# Altium schematic sheet FIT_HDMI_X25-29.SchDoc: FIT_PM12 board
size 420 x 297 mm; CheckedBy: G.Kasprowicz; Author: INR Moscow; CompanyName: WUT ISE; DrawnBy: M.Podgórski; Organization: WUT ISE; Address1: PW ISE; Address2: Nowowiejska 15/19 00-665 Warsaw; Address3: gkasprow@gmail.com; Revision: 2; SheetNumber: -; SheetTotal: -; ModifiedBy: -; CheckedDate: -; Title2: Title 2; DivGrp: WUT ISE; Designer: INR RAS; ModifiedDate: -; ProjectName: Sensor Box
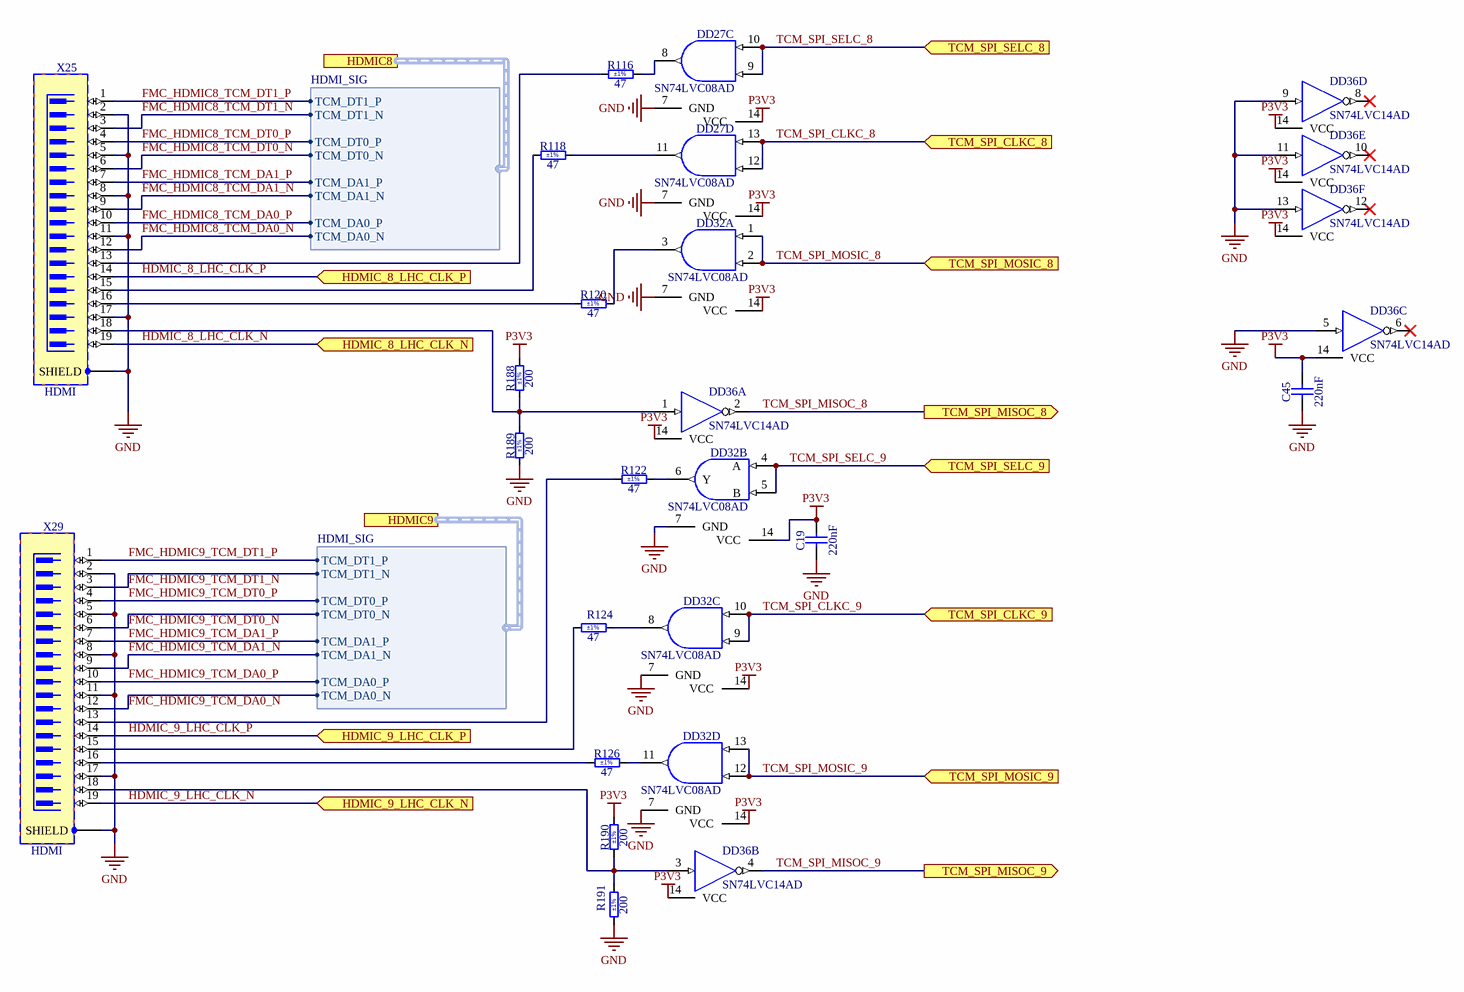
[diagram p0: FIT_HDMI_X25-29.SchDoc]

## Parts
C19  220nF  [CAPC2012X135N]
C45  220nF  [CAPC2012X135N]
DD27  SN74LVC08AD  [SOIC127P600X175-14N]  (parts C,D of 4)
DD32  SN74LVC08AD  [SOIC127P600X175-14N]  (parts A,B,C,D of 4)
DD36  SN74LVC14AD  [SOIC127P600X175-14N]  (parts A,B,C,D,E,F of 6)
R116  47  Tolerance: ±1%  [RESC2012X60N]
R118  47  Tolerance: ±1%  [RESC2012X60N]
R120  47  Tolerance: ±1%  [RESC2012X60N]
R122  47  Tolerance: ±1%  [RESC2012X60N]
R124  47  Tolerance: ±1%  [RESC2012X60N]
R126  47  Tolerance: ±1%  [RESC2012X60N]
R188  200  Tolerance: ±1%  [RESC2012X60N]
R189  200  Tolerance: ±1%  [RESC2012X60N]
R190  200  Tolerance: ±1%  [RESC2012X60N]
R191  200  Tolerance: ±1%  [RESC2012X60N]
X25  HDMI  [TYCO_2007435-1]
X29  HDMI  [TYCO_2007435-1]

## Ports
HDMIC8 (harness HDMI_SIG), HDMIC9 (harness HDMI_SIG), HDMIC_8_LHC_CLK_N (in), HDMIC_8_LHC_CLK_P (in), HDMIC_9_LHC_CLK_N (in), HDMIC_9_LHC_CLK_P (in), TCM_SPI_CLKC_8 (in), TCM_SPI_CLKC_9 (in), TCM_SPI_MISOC_8 (out), TCM_SPI_MISOC_9 (out), TCM_SPI_MOSIC_8 (in), TCM_SPI_MOSIC_9 (in), TCM_SPI_SELC_8 (in), TCM_SPI_SELC_9 (in)

## Harnesses
HDMI_SIG: TCM_DT1_P, TCM_DT1_N, TCM_DT0_P, TCM_DT0_N, TCM_DA1_P, TCM_DA1_N, TCM_DA0_P, TCM_DA0_N

## Nets
GND: C19.1 C45.1 DD27.7(GND) DD32.7(GND) DD36.5(IN) DD36.7(GND) DD36.9(IN) DD36.11(IN) DD36.13(IN) R189.1 R191.1 X25.2 X25.5 X25.8 X25.11 X25.17 X25.SHIELD X29.2 X29.5 X29.8 X29.11 X29.17 X29.SHIELD
P3V3: C19.2 C45.2 DD27.14(VCC) DD32.14(VCC) DD36.14(VCC) R188.2 R190.2  [also labelled VCC]
FMC_HDMIC8_TCM_DA0_N: X25.12 ; port HDMIC8.TCM_DA0_N
FMC_HDMIC8_TCM_DA0_P: X25.10 ; port HDMIC8.TCM_DA0_P
FMC_HDMIC8_TCM_DA1_N: X25.9 ; port HDMIC8.TCM_DA1_N
FMC_HDMIC8_TCM_DA1_P: X25.7 ; port HDMIC8.TCM_DA1_P
FMC_HDMIC8_TCM_DT0_N: X25.6 ; port HDMIC8.TCM_DT0_N
FMC_HDMIC8_TCM_DT0_P: X25.4 ; port HDMIC8.TCM_DT0_P
FMC_HDMIC8_TCM_DT1_N: X25.3 ; port HDMIC8.TCM_DT1_N
FMC_HDMIC8_TCM_DT1_P: X25.1 ; port HDMIC8.TCM_DT1_P
FMC_HDMIC9_TCM_DA0_N: X29.12 ; port HDMIC9.TCM_DA0_N
FMC_HDMIC9_TCM_DA0_P: X29.10 ; port HDMIC9.TCM_DA0_P
FMC_HDMIC9_TCM_DA1_N: X29.9 ; port HDMIC9.TCM_DA1_N
FMC_HDMIC9_TCM_DA1_P: X29.7 ; port HDMIC9.TCM_DA1_P
FMC_HDMIC9_TCM_DT0_N: X29.6 ; port HDMIC9.TCM_DT0_N
FMC_HDMIC9_TCM_DT0_P: X29.4 ; port HDMIC9.TCM_DT0_P
FMC_HDMIC9_TCM_DT1_N: X29.3 ; port HDMIC9.TCM_DT1_N
FMC_HDMIC9_TCM_DT1_P: X29.1 ; port HDMIC9.TCM_DT1_P
HDMIC_8_LHC_CLK_N: X25.19 ; port HDMIC_8_LHC_CLK_N
HDMIC_8_LHC_CLK_P: X25.14 ; port HDMIC_8_LHC_CLK_P
HDMIC_9_LHC_CLK_N: X29.19 ; port HDMIC_9_LHC_CLK_N
HDMIC_9_LHC_CLK_P: X29.14 ; port HDMIC_9_LHC_CLK_P
TCM_SPI_CLKC_8: DD27.12(B) DD27.13(A) ; port TCM_SPI_CLKC_8
TCM_SPI_CLKC_9: DD32.9(B) DD32.10(A) ; port TCM_SPI_CLKC_9
TCM_SPI_MISOC_8: DD36.2(OUT) ; port TCM_SPI_MISOC_8
TCM_SPI_MISOC_9: DD36.4(OUT) ; port TCM_SPI_MISOC_9
TCM_SPI_MOSIC_8: DD32.1(A) DD32.2(B) ; port TCM_SPI_MOSIC_8
TCM_SPI_MOSIC_9: DD32.12(B) DD32.13(A) ; port TCM_SPI_MOSIC_9
TCM_SPI_SELC_8: DD27.9(B) DD27.10(A) ; port TCM_SPI_SELC_8
TCM_SPI_SELC_9: DD32.4(A) DD32.5(B) ; port TCM_SPI_SELC_9
NetDD27_8: DD27.8(Y) R116.2
NetDD27_11: DD27.11(Y) R118.2
NetDD32_3: DD32.3(Y) R120.2
NetDD32_6: DD32.6(Y) R122.2
NetDD32_8: DD32.8(Y) R124.2
NetDD32_11: DD32.11(Y) R126.2
NetDD36_1: DD36.1(IN) R188.1 R189.2 X25.18
NetDD36_3: DD36.3(IN) R190.1 R191.2 X29.18
NetR116_1: R116.1 X25.13
NetR118_1: R118.1 X25.15
NetR120_1: R120.1 X25.16
NetR122_1: R122.1 X29.13
NetR124_1: R124.1 X29.15
NetR126_1: R126.1 X29.16

Not connected (* = marked no-connect by the designer): DD36 6(OUT)* 8(OUT)* 10(OUT)* 12(OUT)*

## Notes on the sheet
- Project/Equipment
- Document
- Designer
- Drawn by
- Check.by
- Copyright WUT ISE 2024.
  This documentation describes Open Hardware and is licensed under the CERN OHL v.2. You may redistribute and modify this documentation under the terms of the CERN OHL v.2. (http://ohwr.org/CERNOHL). This documentation is distributed WITHOUT ANY EXPRESS OR IMPLIED WARRANTY, INCLUDING OF MERCHANTABILITY, SATISFACTORY QUALITY AND FITNESS FOR A PARTICULAR PURPOSE. Please see the CERN OHL v.2 for applicable conditions.
- Contact
- File
- Last Mod.
- Print Date
- Sheet
- Size
- A3
- of
- Rev

## Library data of the parts
C19 C45 = CC0805_220NF_50V_10%_X7R: Non-polarised capacitor; Part Description: SMD Multilayer Chip Ceramic Capacitor; Manufacturer: GENERIC; Manufacturer1 Part Number: GRM21BR71H224KA01L; Voltage: 50V; TC: X7R; Tolerance: ±10%; Part Number: CC0805_220NF_50V_10%_X7R; Component Kind: Standard; Component Type: Standard; Pin Count: 2; Value: 220nF; Status: Preferred; Manufacturer Part Number: CC0805_220NF_50V_10%_X7R; Case: 0805; Mounted: Yes; Socket: No; SMD: Yes; Sense: No; Manufacturer1 Example: MURATA; Manufacturer1 ComponentHeight: 1.35mm; HelpURL: \\cern.ch\dfs\Applications\Altium\Datasheets\CC0805_X7R_MURATA.pdf; Author: CERN DEM JLC; CreateDate: 03.12.2007; LatestRevisionDate: 03.12.2007
DD27 DD32 = SN74LVC08AD: Quad 2-Input AND Gate; Part Description: Quadruple 2-Input Positive-AND Gate; Manufacturer: TEXAS INSTRUMENTS; PressFit: No; Bonding: No; Part Number: SN74LVC08AD; Component Kind: Standard; Component Type: Standard; Device: SN74LVC08AD; PackageDescription: SOIC 14, Pitch 1.27mm - Body 4x8.75mm, IPC Medium Density; Manufacturer Part Number: SN74LVC08AD; Pin Count: 14; Case: SOIC14; Mounted: Yes; Socket: No; SMD: Yes; Sense: No; ComponentHeight: 1.75mm; Author: CERN DEM JLC; HelpURL: \\cern.ch\dfs\Applications\Altium\Datasheets\SN74LVC08AD.pdf; CreateDate: 21.03.2012; LatestRevisionDate: 21.03.2012
DD36 = SN74LVC14AD: Hex Schmitt-Trigger Inverter; Manufacturer: TEXAS INSTRUMENTS; PressFit: No; Bonding: No; Part Number: SN74LVC14AD; Component Kind: Standard; Component Type: Standard; Device: SN74LVC14AD; PackageDescription: SOIC 14, Pitch 1.27mm - Body 4x8.75mm, IPC Medium Density; Part Description: Hex Schmitt-Trigger Inverter; Manufacturer Part Number: SN74LVC14AD; Pin Count: 14; Case: SOIC14; Mounted: Yes; Socket: No; SMD: Yes; Sense: No; ComponentHeight: 1.75mm; Author: CERN DEM JMW; HelpURL: \\cern.ch\dfs\Applications\Altium\Datasheets\SN74LVC14AD.pdf; CreateDate: 29.09.2008; LatestRevisionDate: 29.09.2008
R116 R118 R120 R122 R124 R126 = R0805_47R_1%_0.125W_100PPM: Resistor - 1%; Part Description: General Purpose Thick Film Chip Resistor; Manufacturer: GENERIC; Manufacturer1 Part Number: NRC10F47R0TRF; Power: 0.125W; TC: ±100ppm/°C; PressFit: No; Part Number: R0805_47R_1%_0.125W_100PPM; Component Kind: Standard; Component Type: Standard; Pin Count: 2; Value: 47; Status: Preferred; Manufacturer Part Number: R0805_47R_1%_0.125W_100PPM; Case: 0805; Mounted: Yes; Sense: No; Socket: No; SMD: Yes; Manufacturer1 Example: NIC COMPONENT; Manufacturer1 ComponentHeight: 0.6mm; HelpURL: \\cern.ch\dfs\Applications\Altium\Datasheets\R0805_NIC_NRC.pdf; Author: CERN DEM JLC; CreateDate: 03.12.2007; LatestRevisionDate: 13.03.2008
R188-R191 = R0805_200R_1%_0.125W_100PPM: Resistor - 1%; Part Description: General Purpose Thick Film Chip Resistor; Manufacturer: GENERIC; Manufacturer1 Part Number: NRC10F2000TRF; Power: 0.125W; TC: ±100ppm/°C; PressFit: No; Part Number: R0805_200R_1%_0.125W_100PPM; Component Kind: Standard; Component Type: Standard; Pin Count: 2; Value: 200; Status: Preferred; Manufacturer Part Number: R0805_200R_1%_0.125W_100PPM; Case: 0805; Mounted: Yes; Sense: No; Socket: No; SMD: Yes; Manufacturer1 Example: NIC COMPONENT; Manufacturer1 ComponentHeight: 0.6mm; HelpURL: \\cern.ch\dfs\Applications\Altium\Datasheets\R0805_NIC_NRC.pdf; Author: CERN DEM JLC; CreateDate: 03.12.2007; LatestRevisionDate: 13.03.2008
X25 X29 = TYCO_2007435-1: Connector HDMI 19 Male + 1 Shield; Part Description: 0.578mm Pitch, Through-Hole Right Angle 19 Contacts Flag-HDMI Type-A Receptacle Thru Hole Mounting Pads; Manufacturer: TYCO ELECTRONICS; PressFit: No; Part Number: TYCO_2007435-1; Component Kind: Standard; Component Type: Standard; Pin Count: 23; Family: HDMI; Mounted: Yes; Socket: No; SMD: No; Sense: No; Status: None; Manufacturer Part Number: 2007435-1; ComponentHeight: 16.4mm; HelpURL: \\cern.ch\dfs\Applications\Altium\Datasheets\TYCO_2007435-1.pdf; Author: CERN DEM MR; CreateDate: 05.07.2016; LatestRevisionDate: 05.07.2016